# Altium schematic sheet DB.SchDoc
size A
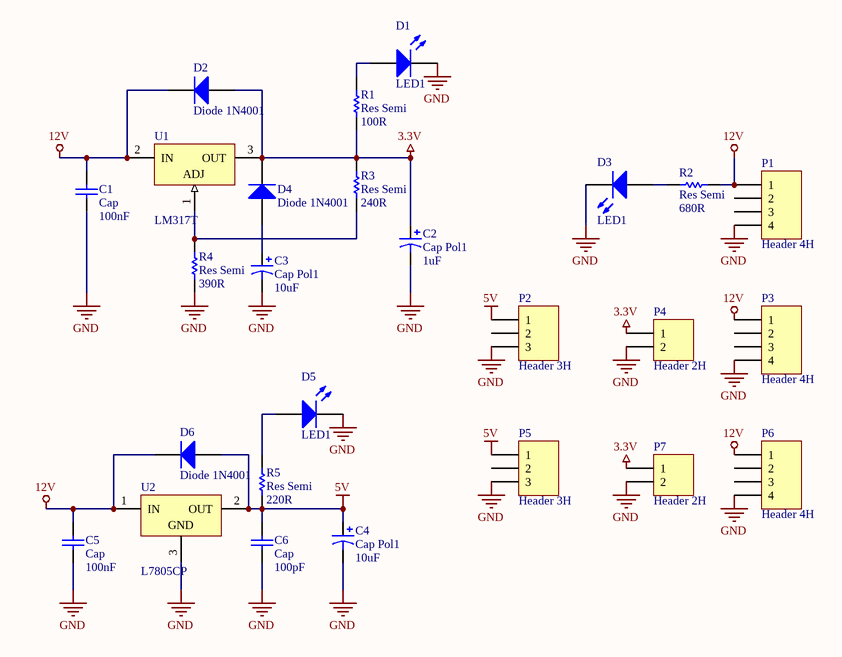
[diagram p0: DB.SchDoc]

## Parts
C1  Cap  value 100nF  [CAPR5.08-7.8x3.2]
C2  Cap Pol1  value 1uF  [CAPPR2-5x6.8]
C3  Cap Pol1  value 10uF  [CAPPR2-5x6.8]
C4  Cap Pol1  value 10uF  [CAPPR2-5x6.8]
C5  Cap  value 100nF  [CAPR5.08-7.8x3.2]
C6  Cap  value 100pF  [CAPR5.08-7.8x3.2]
D1  LED1  [LED-1]
D2  Diode 1N4001  [DIO10.46-5.3x2.8]
D3  LED1  [LED-1]
D4  Diode 1N4001  [DIO10.46-5.3x2.8]
D5  LED1  [LED-1]
D6  Diode 1N4001  [DIO10.46-5.3x2.8]
P1  Header 4H  [HDR1X4H]
P2  Header 3H  [HDR1X3H]
P3  Header 4H  [HDR1X4H]
P4  Header 2H  [HDR1X2H]
P5  Header 3H  [HDR1X3H]
P6  Header 4H  [HDR1X4H]
P7  Header 2H  [HDR1X2H]
R1  Res Semi  value 100R  [RES10-7.8X2.8]
R2  Res Semi  value 680R  [RES10-7.8X2.8]
R3  Res Semi  value 240R  [RES10-7.8X2.8]
R4  Res Semi  value 390R  [RES10-7.8X2.8]
R5  Res Semi  value 220R  [RES10-7.8X2.8]
U1  LM317T  [TO220ABN]
U2  L7805CP  [221A-04]

## Nets
3.3V: C2.1 D2.1(A) D4.2(K) P4.1 P7.1 R1.1 R3.2 U1.3(OUT)
5V: C4.1 C6.1 D6.1(A) P2.1 P5.1 R5.1 U2.2(OUT)
12V: C1.1 C5.1 D2.2(K) D6.2(K) P1.1 P3.1 P6.1 R2.1 U1.2(IN) U2.1(IN)
GND: C1.2 C2.2 C3.2 C4.2 C5.2 C6.2 D1.2(K) D3.2(K) D5.2(K) P1.4 P2.3 P3.4 P4.2 P5.3 P6.4 P7.2 R4.1 U2.3(GND)
NetC3_1: C3.1 D4.1(A)
NetD1_1: D1.1(A) R1.2
NetD3_1: D3.1(A) R2.2
NetD5_1: D5.1(A) R5.2
NetR3_1: R3.1 R4.2 U1.1(ADJ)

Not connected (* = marked no-connect by the designer): P1 2 3; P2 2; P3 2 3; P5 2; P6 2 3

## Library data of the parts
C1 C5 C6 = Cap: Capacitor; Published: 8-Jun-2000; LatestRevisionDate: 17-Jul-2002; LatestRevisionNote: Re-released for DXP Platform.; PackageReference: RAD-0.3; Publisher: Altium Limited
C2-C4 = Cap Pol1: Polarized Capacitor (Radial); Published: 8-Jun-2000; LatestRevisionDate: 17-Jul-2002; LatestRevisionNote: Re-released for DXP Platform.; PackageReference: RB7.6-15; Publisher: Altium Limited
D1 D3 D5 = LED1: Typical RED GaAs LED; Published: 8-Jun-2000; LatestRevisionDate: 08-Jul-2005; LatestRevisionNote: Mech Layer 1 removed.; PackageReference: LED-1; Publisher: Altium Limited
D2 D4 D6 = Diode 1N4007: 1 Amp General Purpose Rectifier; Published: 8-Jun-2000; LatestRevisionDate: 17-Jul-2002; LatestRevisionNote: Re-released for DXP Platform.; DatasheetVersion: 1998; PackageVersion: Aug-1999; PackageReference: DO-41; Publisher: Altium Limited; Code_JEDEC: DO-204-AL; ComponentLink1Description: Manufacturer Link; ComponentLink1URL: http://www.fairchildsemi.com/; ComponentLink2Description: Datasheet; ComponentLink2URL: http://www.fairchildsemi.com/ds/1N%2F1N4001.pdf
P1 P3 P6 = Header 4H: Header, 4-Pin, Right Angle; LatestRevisionDate: 17-Jul-2002; LatestRevisionNote: Re-released for DXP Platform.; Publisher: Altium Limited
P2 P5 = Header 3H: Header, 3-Pin, Right Angle; LatestRevisionDate: 17-Jul-2002; LatestRevisionNote: Re-released for DXP Platform.; Publisher: Altium Limited
P4 P7 = Header 2H: Header, 2-Pin, Right Angle; LatestRevisionDate: 17-Jul-2002; LatestRevisionNote: Re-released for DXP Platform.; Publisher: Altium Limited
R1-R5 = Res Semi: Semiconductor Resistor; Published: 8-Jun-2000; LatestRevisionDate: 17-Jul-2002; LatestRevisionNote: Re-released for DXP Platform.; PackageReference: AXIAL-0.5; Publisher: Altium Limited
U1 = LM317T: 1.2V to 37V Voltage Regulator; Note: Tab is connected to pin 3 (OUT).; Published: 24-Aug-2001; LatestRevisionDate: 17-Jul-2002; LatestRevisionNote: Re-released for DXP Platform.; DatasheetVersion: Nov-1999; PackageVersion: Jun-1998; PackageReference: TO220ABN; Publisher: Altium Limited; PackageDescription: TO, Thru-Hole, Vertical, Heatsink Mounted; 3 In-Line Leads; Pitch 2.54 mm; Pin sequence 1, 3, 2; ComponentLink1Description: Manufacturer Link; ComponentLink1URL: http://www.st.com/; ComponentLink2Description: Datasheet; ComponentLink2URL: http://www.st.com/stonline/products/literature/ds/2154/lm117.pdf
U2 = L7805CP: Positive Voltage Regulator; Note: Tab is connected to pin 3 (GND).; Published: 24-Aug-2001; LatestRevisionDate: 17-Jul-2002; LatestRevisionNote: Re-released for DXP Platform.; DatasheetVersion: Dec-1998; PackageVersion: Jul-1998; PackageReference: ISOWATT220AB; Publisher: Altium Limited; PackageDescription: TO, Thru-Hole, Vertical, Heatsink Mounted; 3 In-Line Leads; Pitch 2.54 mm; Pin sequence 1, 3, 2; ComponentLink1Description: Manufacturer Link; ComponentLink1URL: http://www.st.com/